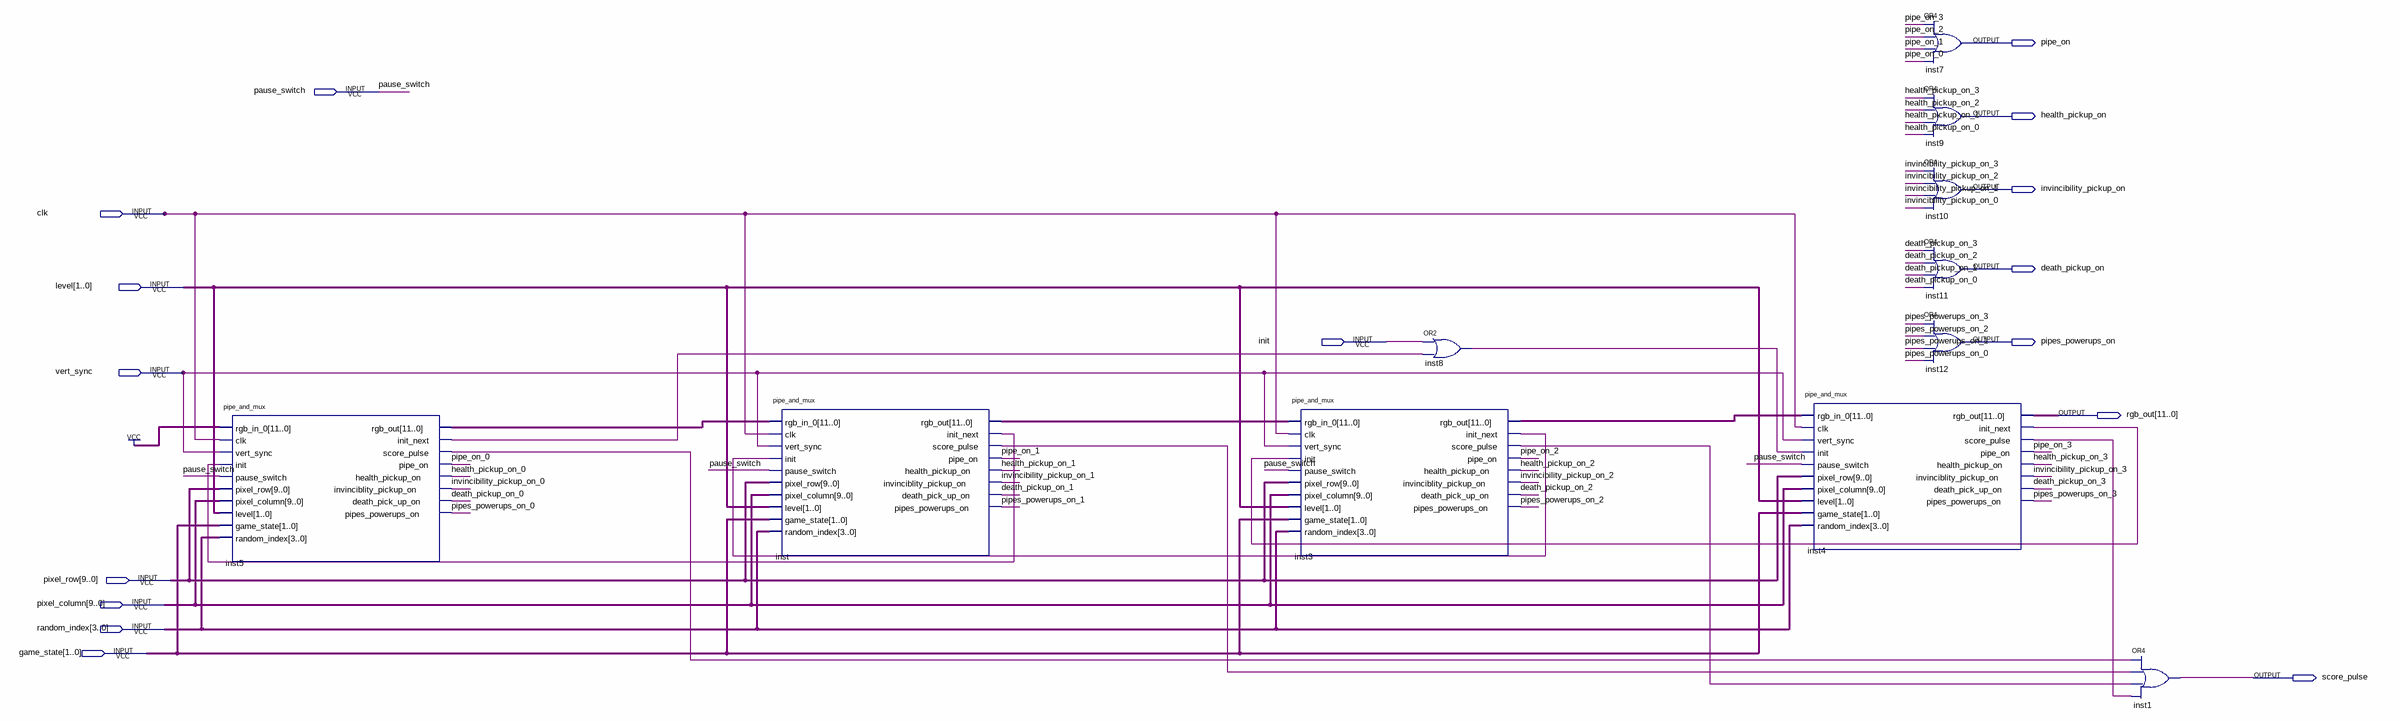
[diagram p0: schematic sheet]
// Quartus schematic pipes.bdf as structural Verilog: 11 symbols, 16 pins
module pipes (
  input  pause_switch,
  input  clk,
  input  [1:0] level,
  input  init,
  input  vert_sync,
  input  [9:0] pixel_row,
  input  [9:0] pixel_column,
  input  [3:0] random_index,
  input  [1:0] game_state,
  output pipe_on,
  output health_pickup_on,
  output invincibility_pickup_on,
  output death_pickup_on,
  output pipes_powerups_on,
  output [11:0] rgb_out,
  output score_pulse
);

  wire death_pickup_on_0, death_pickup_on_1, death_pickup_on_2, death_pickup_on_3, health_pickup_on_0,
       health_pickup_on_1, health_pickup_on_2, health_pickup_on_3, inst3_init_next, inst3_score_pulse,
       inst4_init_next, inst4_score_pulse, inst5_init_next, inst5_score_pulse, inst8_out, inst_init_next,
       inst_score_pulse, invincibility_pickup_on_0, invincibility_pickup_on_1, invincibility_pickup_on_2,
       invincibility_pickup_on_3, pipe_on_0, pipe_on_1, pipe_on_2, pipe_on_3, pipes_powerups_on_0,
       pipes_powerups_on_1, pipes_powerups_on_2, pipes_powerups_on_3;
  wire [11:0] inst3_rgb_out, inst5_rgb_out, inst_rgb_out;

  pipe_and_mux inst5 (
    .rgb_in_0({12{1'b1}}), .clk(clk), .vert_sync(vert_sync), .init(inst_init_next),
    .pause_switch(pause_switch), .pixel_row(pixel_row), .pixel_column(pixel_column), .level(level),
    .game_state(game_state), .random_index(random_index), .rgb_out(inst5_rgb_out),
    .init_next(inst5_init_next), .score_pulse(inst5_score_pulse), .pipe_on(pipe_on_0),
    .health_pickup_on(health_pickup_on_0), .invinciblity_pickup_on(invincibility_pickup_on_0),
    .death_pick_up_on(death_pickup_on_0), .pipes_powerups_on(pipes_powerups_on_0));
  pipe_and_mux inst (
    .rgb_in_0(inst5_rgb_out), .clk(clk), .vert_sync(vert_sync), .init(inst3_init_next),
    .pause_switch(pause_switch), .pixel_row(pixel_row), .pixel_column(pixel_column), .level(level),
    .game_state(game_state), .random_index(random_index), .rgb_out(inst_rgb_out), .init_next(inst_init_next),
    .score_pulse(inst_score_pulse), .pipe_on(pipe_on_1), .health_pickup_on(health_pickup_on_1),
    .invinciblity_pickup_on(invincibility_pickup_on_1), .death_pick_up_on(death_pickup_on_1),
    .pipes_powerups_on(pipes_powerups_on_1));
  pipe_and_mux inst3 (
    .rgb_in_0(inst_rgb_out), .clk(clk), .vert_sync(vert_sync), .init(inst4_init_next),
    .pause_switch(pause_switch), .pixel_row(pixel_row), .pixel_column(pixel_column), .level(level),
    .game_state(game_state), .random_index(random_index), .rgb_out(inst3_rgb_out),
    .init_next(inst3_init_next), .score_pulse(inst3_score_pulse), .pipe_on(pipe_on_2),
    .health_pickup_on(health_pickup_on_2), .invinciblity_pickup_on(invincibility_pickup_on_2),
    .death_pick_up_on(death_pickup_on_2), .pipes_powerups_on(pipes_powerups_on_2));
  or inst8 (inst8_out, init, inst5_init_next);
  pipe_and_mux inst4 (
    .rgb_in_0(inst3_rgb_out), .clk(clk), .vert_sync(vert_sync), .init(inst8_out),
    .pause_switch(pause_switch), .pixel_row(pixel_row), .pixel_column(pixel_column), .level(level),
    .game_state(game_state), .random_index(random_index), .rgb_out(rgb_out), .init_next(inst4_init_next),
    .score_pulse(inst4_score_pulse), .pipe_on(pipe_on_3), .health_pickup_on(health_pickup_on_3),
    .invinciblity_pickup_on(invincibility_pickup_on_3), .death_pick_up_on(death_pickup_on_3),
    .pipes_powerups_on(pipes_powerups_on_3));
  or inst7 (pipe_on, pipe_on_3, pipe_on_2, pipe_on_1, pipe_on_0);
  or inst9 (health_pickup_on, health_pickup_on_3, health_pickup_on_2, health_pickup_on_1, health_pickup_on_0);
  or inst10 (invincibility_pickup_on, invincibility_pickup_on_3, invincibility_pickup_on_2, invincibility_pickup_on_1, invincibility_pickup_on_0);
  or inst11 (death_pickup_on, death_pickup_on_3, death_pickup_on_2, death_pickup_on_1, death_pickup_on_0);
  or inst12 (pipes_powerups_on, pipes_powerups_on_3, pipes_powerups_on_2, pipes_powerups_on_1, pipes_powerups_on_0);
  or inst1 (score_pulse, inst5_score_pulse, inst_score_pulse, inst3_score_pulse, inst4_score_pulse);
endmodule
